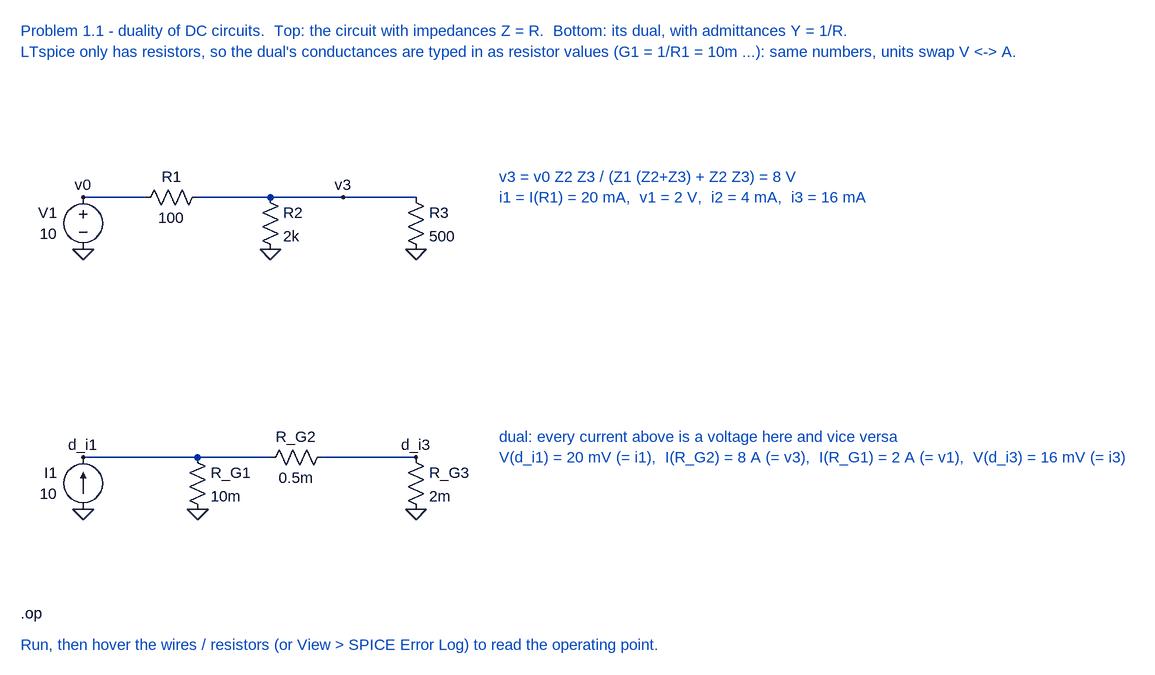
[diagram p0: schematic P1_1_DC_Duality.asc]
P1_1_DC_Duality.asc, the LTspice schematic file:
Version 4
SHEET 1 3000 1600
WIRE 0 0 96 0
WIRE 176 0 512 0
WIRE 0 400 288 400
WIRE 368 400 512 400
FLAG 0 80 0
FLAG 0 0 v0
FLAG 400 0 v3
FLAG 288 80 0
FLAG 512 80 0
FLAG 0 480 0
FLAG 0 400 d_i1
FLAG 176 480 0
FLAG 512 400 d_i3
FLAG 512 480 0
SYMBOL voltage 0 -16 R0
WINDOW 0 -40 40 Right 2
WINDOW 3 -40 72 Right 2
SYMATTR InstName V1
SYMATTR Value 10
SYMBOL res 192 -16 R90
WINDOW 0 0 56 VBottom 2
WINDOW 3 32 56 VTop 2
SYMATTR InstName R1
SYMATTR Value 100
SYMBOL res 272 -16 R0
SYMATTR InstName R2
SYMATTR Value 2k
SYMBOL res 496 -16 R0
SYMATTR InstName R3
SYMATTR Value 500
SYMBOL current 0 480 R180
WINDOW 0 40 56 Left 2
WINDOW 3 40 24 Left 2
SYMATTR InstName I1
SYMATTR Value 10
SYMBOL res 160 384 R0
SYMATTR InstName R_G1
SYMATTR Value 10m
SYMBOL res 384 384 R90
WINDOW 0 0 56 VBottom 2
WINDOW 3 32 56 VTop 2
SYMATTR InstName R_G2
SYMATTR Value 0.5m
SYMBOL res 496 384 R0
SYMATTR InstName R_G3
SYMATTR Value 2m
TEXT -96 -256 Left 2 ;Problem 1.1 - duality of DC circuits.  Top: the circuit with impedances Z = R.  Bottom: its dual, with admittances Y = 1/R.
TEXT -96 -224 Left 2 ;LTspice only has resistors, so the dual's conductances are typed in as resistor values (G1 = 1/R1 = 10m ...): same numbers, units swap V <-> A.
TEXT 640 -32 Left 2 ;v3 = v0 Z2 Z3 / (Z1 (Z2+Z3) + Z2 Z3) = 8 V
TEXT 640 0 Left 2 ;i1 = I(R1) = 20 mA,  v1 = 2 V,  i2 = 4 mA,  i3 = 16 mA
TEXT 640 368 Left 2 ;dual: every current above is a voltage here and vice versa
TEXT 640 400 Left 2 ;V(d_i1) = 20 mV (= i1),  I(R_G2) = 8 A (= v3),  I(R_G1) = 2 A (= v1),  V(d_i3) = 16 mV (= i3)
TEXT -96 640 Left 2 !.op
TEXT -96 688 Left 2 ;Run, then hover the wires / resistors (or View > SPICE Error Log) to read the operating point.

The netlist it stands for:
* P1_1_DC_Duality.asc
V1 v0 0 10
R1 v3 v0 100
R2 v3 0 2k
R3 v3 0 500
I1 0 d_i1 10
R_G1 d_i1 0 10m
R_G2 d_i3 d_i1 0.5m
R_G3 d_i3 0 2m
* Problem 1.1 - duality of DC circuits.  Top: the circuit with impedances Z = R.  Bottom: its dual, with admittances Y = 1/R.
* LTspice only has resistors, so the dual's conductances are typed in as resistor values (G1 = 1/R1 = 10m ...): same numbers, units swap V <-> A.
* v3 = v0 Z2 Z3 / (Z1 (Z2+Z3) + Z2 Z3) = 8 V
* i1 = I(R1) = 20 mA,  v1 = 2 V,  i2 = 4 mA,  i3 = 16 mA
* dual: every current above is a voltage here and vice versa
* V(d_i1) = 20 mV (= i1),  I(R_G2) = 8 A (= v3),  I(R_G1) = 2 A (= v1),  V(d_i3) = 16 mV (= i3)
.op
* Run, then hover the wires / resistors (or View > SPICE Error Log) to read the operating point.
.backanno
.end